# EAGLE design crawler2head (EAGLE 8.5.0)
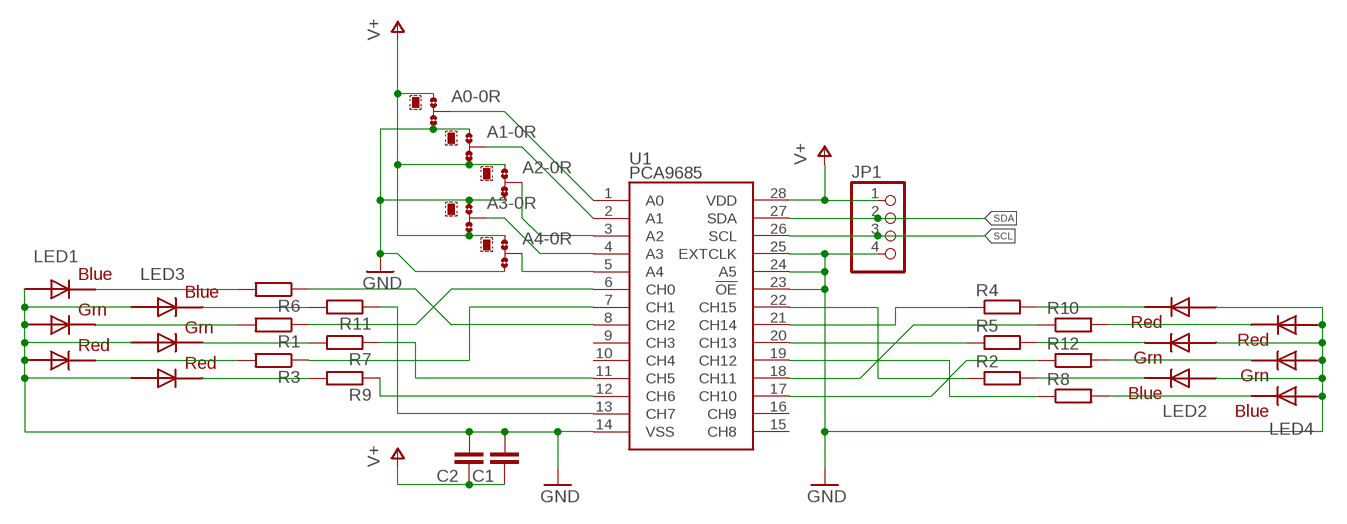
[diagram p0: schematic, sheet 1]

## Parts
A0  A0  0R-JUMPB  [B0R-JMP]
A1  0R-JUMPB  [B0R-JMP]
A2  0R-JUMPB  [B0R-JMP]
A3  0R-JUMPB  [B0R-JMP]
A4  0R-JUMPB  [B0R-JMP]
C1  C-EUC3216  [C3216]
C2  C-EUC0603  [C0603]
JP1  PINHD-1X4/90  [1X04/90]
LED1  RGBLED5050  [RGBLED5050]
LED2  RGBLED5050  [RGBLED5050]
LED3  RGBLED5050  [RGBLED5050]
LED4  RGBLED5050  [RGBLED5050]
R1  R-EU_R0603  [R0603]
R2  R-EU_R0603  [R0603]
R3  R-EU_R0603  [R0603]
R4  R-EU_R0603  [R0603]
R5  R-EU_R0603  [R0603]
R6  R-EU_R0603  [R0603]
R7  R-EU_R0603  [R0603]
R8  R-EU_R0603  [R0603]
R9  R-EU_R0603  [R0603]
R10  R-EU_R0603  [R0603]
R11  R-EU_R0603  [R0603]
R12  R-EU_R0603  [R0603]
U1  PCA9685  [TSSOP-28_4MM]

## Nets
GND: A0.3 A1.1 A2.3 A3.1 A4.3 C1.2 C2.2 JP1.4 LED1.1(GREEN_A) LED1.2(RED_A) LED1.3(BLUE_A) LED2.1(GREEN_A) LED2.2(RED_A) LED2.3(BLUE_A) LED3.1(GREEN_A) LED3.2(RED_A) LED3.3(BLUE_A) LED4.1(GREEN_A) LED4.2(RED_A) LED4.3(BLUE_A) U1.14(VSS) U1.23(!OE) U1.24(A5) U1.25(EXTCLK)
N$1: A4.2 U1.5(A4)
N$2: A3.2 U1.4(A3)
N$3: A2.2 U1.3(A2)
N$4: A1.2 U1.2(A1)
N$5: A0.2 U1.1(A0)
N$17: LED2.5(RED_C) R4.2
N$18: LED2.6(GREEN_C) R5.2
N$19: LED2.4(BLUE_C) R2.2
N$20: LED4.5(RED_C) R10.2
N$21: LED4.6(GREEN_C) R12.2
N$22: LED4.4(BLUE_C) R8.2
N$23: R2.1 U1.22(CH15)
N$24: R4.1 U1.21(CH14)
N$25: R5.1 U1.20(CH13)
N$26: R8.1 U1.19(CH12)
N$27: R10.1 U1.18(CH11)
N$28: R12.1 U1.17(CH10)
N$29: R11.1 U1.13(CH7)
N$30: R9.1 U1.12(CH6)
N$31: R7.1 U1.11(CH5)
N$32: LED3.5(RED_C) R9.2
N$33: LED3.6(GREEN_C) R7.2
N$34: LED3.4(BLUE_C) R11.2
N$35: LED1.5(RED_C) R3.2
N$36: LED1.6(GREEN_C) R1.2
N$37: LED1.4(BLUE_C) R6.2
N$38: R6.1 U1.8(CH2)
N$39: R3.1 U1.7(CH1)
N$40: R1.1 U1.6(CH0)
SCL: JP1.3 U1.26(SCL)
SDA: JP1.2 U1.27(SDA)
V+: A0.1 A1.3 A2.1 A3.3 A4.1 C1.1 C2.1 JP1.1 U1.28(VDD)
Unconnected: U1.9(CH3) U1.10(CH4) U1.15(CH8) U1.16(CH9)

## Library data of the parts
A0 A1-A4 = jump-0r-smd:0R-JUMP: SMD 0R 0805 Jumper
C1 C2 = rcl:C-EU: CAPACITOR, European symbol; SPICEPREFIX: C
JP1 = pinhead:PINHD-1X4: PIN HEADER
LED1-LED4 = adafruit:RGBLED: For 5050 RGB LEDs, the order of the LEDs may vary from one manufacturer to another!
R1-R12 = rcl:R-EU_: RESISTOR, European symbol; SPICEPREFIX: R
U1 = SparkFun-IC-Special-Function:PCA9685: 16-channel 12-bit PWM I2C interface Internal Oscillator 40Hz to 1kHz Can be totem pole or open collector 2.3V to 5.5V SparkFun Products SparkFun Block for Intel® Edison - PWM <https://www.sparkfun.com/products/13042> (DEV-13042) PROTO: IC-12240 PROD_ID: IC-12271; PROD_ID: IC-12271

## Board
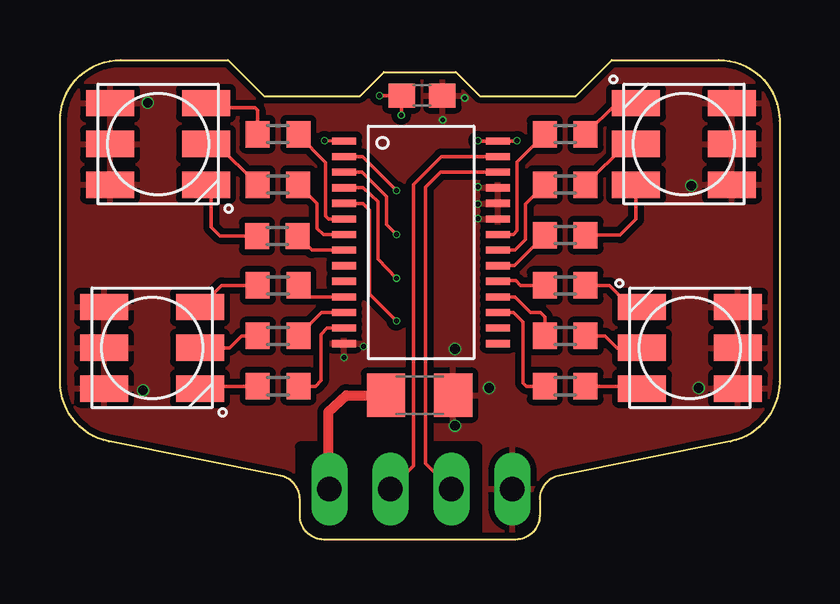
[diagram p1: board, top side]
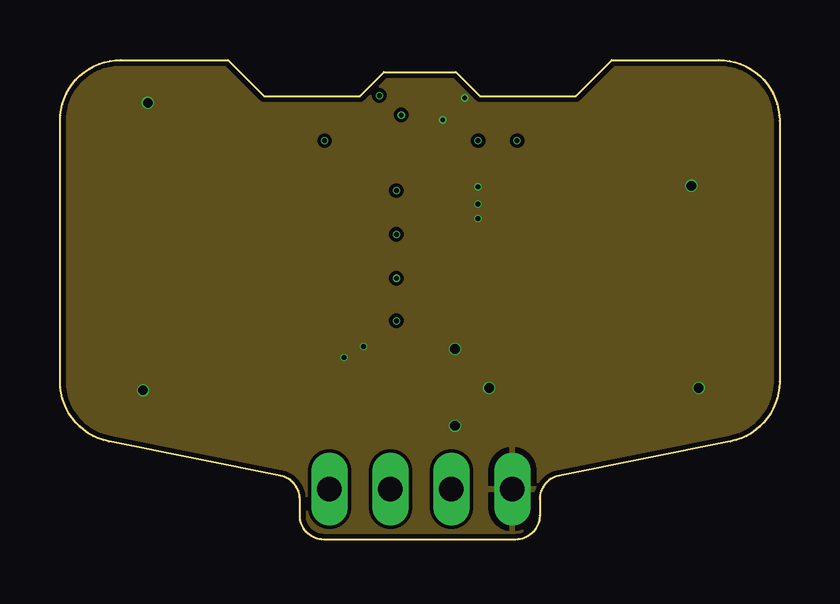
[diagram p2: board, inner layer Route2]
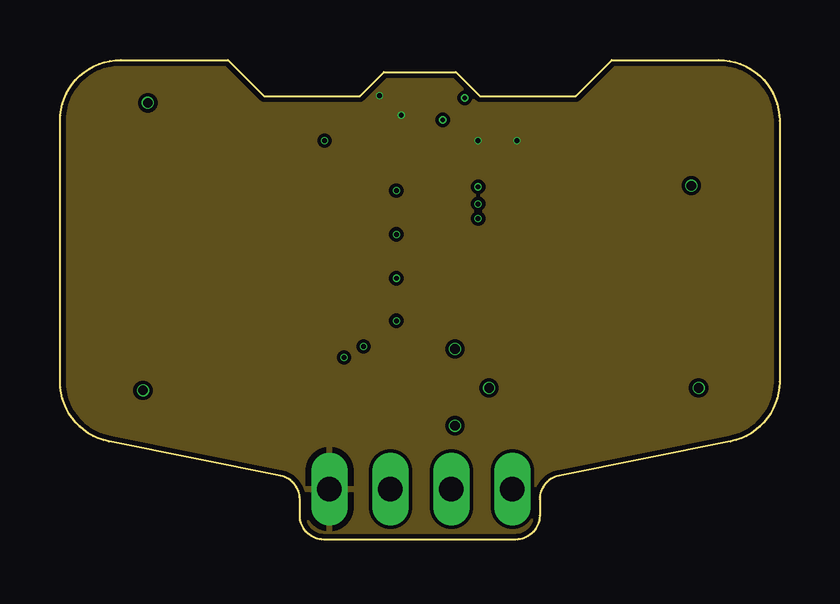
[diagram p3: board, inner layer Route15]
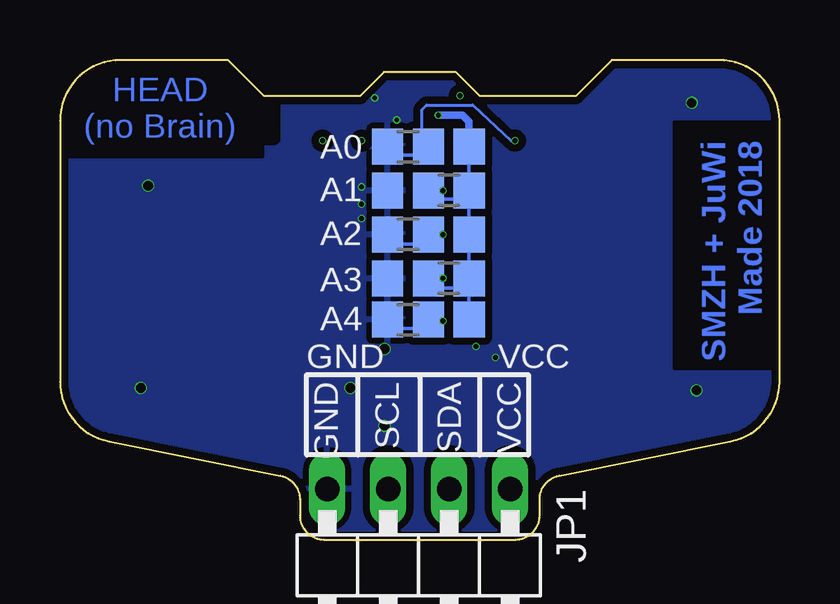
[diagram p4: board, bottom side, seen from below]

Size 30 x 20 mm. Coordinates in mm from the lower left corner, seen from the top.
Outline: 27.96,4.09 20.8,2.66 arc79 20,1.68 20,1 arc-90 19,0 11,0 arc-90 10,1 10,1.68 arc79 9.2,2.66 2.04,4.09 arc-79 0,6.58 0,17.46 arc-90 2.54,20 7,20 8.5,18.5 12.5,18.5 13.5,19.5 16.5,19.5 17.5,18.5 21.5,18.5 23,20 27.46,20 arc-90 30,17.46 30,6.58 arc-79 27.96,4.09
Copper layers (1+2*15+16): Top 0.035mm / dielectric 0.45mm / Route2 0.035mm / dielectric 0.45mm / Route15 0.035mm / dielectric 0.45mm / Bottom 0.035mm
Design rules "aisler_go_2layer *": minimum track width 0.1mm, minimum drill 0.2mm, track to track 0.15mm, track to pad 0.15mm, pad to pad 0.15mm, via to via 0.15mm, smd to smd 0mil, copper to edge 0.2mm, drill to drill 0.21mm, minimum pad ring 0.25mm, minimum via ring 0.05mm, stop-mask expansion 0.01mm, vias tented up to drill 48mil, thermal gap 10mil

### Footprints (pad centres in the part's own frame; a part is rotated, then mirrored left to right if it is on the bottom)
B0R-JMP = smd 1.5 x 1.3: 1 0,1.7; 2 0,0; 3 0,-1.7
C3216 = smd 1.6 x 1.8: 1 -1.4,0; 2 1.4,0
C0603 = smd 1.1 x 1: 1 -0.85,0; 2 0.85,0
1X04/90 = drill 1.016 long: 1 -3.81,-3.81; 2 -1.27,-3.81; 3 1.27,-3.81; 4 3.81,-3.81
RGBLED5050 = smd 2 x 1.1: 1 -2,1.7; 2 -2,0; 3 -2,-1.7; 4 2,-1.7; 5 2,0; 6 2,1.7
R0603 = smd 1 x 1.1: 1 -0.85,0; 2 0.85,0
TSSOP-28_4MM = smd 1 x 0.3: 1 -3.2,4.225; 2 -3.2,3.575; 3 -3.2,2.925; 4 -3.2,2.275; 5 -3.2,1.625; 6 -3.2,0.975; 7 -3.2,0.325; 8 -3.2,-0.325; 9 -3.2,-0.975; 10 -3.2,-1.625; 11 -3.2,-2.275; 12 -3.2,-2.925; 13 -3.2,-3.575; 14 -3.2,-4.225; 15 3.2,-4.225; 16 3.2,-3.575; 17 3.2,-2.925; 18 3.2,-2.275; 19 3.2,-1.625; 20 3.2,-0.975; 21 3.2,-0.325; 22 3.2,0.325; 23 3.2,0.975; 24 3.2,1.625; 25 3.2,2.275; 26 3.2,2.925; 27 3.2,3.575; 28 3.2,4.225

### Placement (x,y rotation side)
A0  14.64,16.38 270 bottom
A1  14.64,14.55 90 bottom
A2  14.64,12.72 270 bottom
A3  14.64,10.9 90 bottom
A4  14.64,9.17 270 bottom
C1  14.99,6.02 0 top
C2  15.1,18.52 0 top
JP1  15.04,-1.7 180 bottom
LED1  4.09,16.5 0 top
LED2  26.01,16.5 180 top
LED3  3.84,8 0 top
LED4  26.26,8 180 top
R1  9.09,16.9 180 top
R2  21.06,16.9 0 top
R3  9.08,14.8 180 top
R4  21.06,14.8 0 top
R5  21.06,12.69 0 top
R6  9.07,12.66 180 top
R7  9.09,10.6 180 top
R8  21.06,10.6 0 top
R9  9.09,8.5 180 top
R10  21.06,8.5 0 top
R11  9.09,6.39 180 top
R12  21.06,6.39 0 top
U1  15.05,12.39 0 top

### Tracks (layer width: path | path; a pad name or v marks a point on that pad's centre or on a via)
GND  (via drill 0.2, 0.4)
  other vias: 17.89,6.32 16.47,7.95 26.63,6.32 26.32,14.76 3.67,18.21 3.46,6.22 15.96,17.5 16.87,18.41 17.43,13.99 17.43,14.71 17.43,13.38 11.84,7.59 12.66,8.05 16.47,4.75
  pour Top (isolate 0.254): -0.5,20.5 30.5,20.5 30.5,0.5 30.5,-0.5 -0.5,-0.5
  pour Bottom (isolate 0.305): -0.5,20.5 30.5,20.5 30.5,0.5 30.5,-0.5 -0.5,-0.5
  pour Route2: -0.5,20.5 30.5,20.5 30.5,0.5 30.5,-0.5 -0.5,-0.5
  cutout Top: 10,3.88 10,0 17.4,0 17.4,3.88
  cutout Bottom: 4.38,17.4 -0.55,17.4 -0.55,7.14 4.38,7.14
  cutout Bottom: 30.23,20.9 30.23,15.98 21.55,15.98 21.55,20.9
N$1  (via drill 0.2)
  Top 0.152: v14.03,9.12 12.91,10.23 12.91,13.74 12.63,14.02 U1.5
  Bottom 0.152: A4.2 14.08,9.17 v14.03,9.12
N$2  (via drill 0.2)
  Top 0.152: v14.03,10.89 13.27,11.71 13.27,14.1 12.64,14.67 U1.4
  Bottom 0.152: A3.2 v14.03,10.89
N$3  (via drill 0.2)
  Top 0.152: v14.03,12.72 13.62,13.13 13.62,14.3 12.6,15.32 U1.3
  Bottom 0.152: A2.2 v14.03,12.72
N$4  (via drill 0.2)
  Top 0.152: v14.03,14.55 12.61,15.97 U1.2
  Bottom 0.152: A1.2 v14.03,14.55
N$5  (via drill 0.2)
  Top 0.127: v11.03,16.64 11.84,16.64 U1.1
  Bottom 0.127: v11.03,16.64 11.21,16.64 12.79,18.12 14.72,18.12 14.9,17.93 14.9,16.9 14.69,16.69 14.55,16.47 A0.2
N$6
  Bottom 0.152: 14.33,14.2 13.32,14.2
N$7
  Bottom 0.152: 16.06,16.03 14.94,16.03
N$8
  Bottom 0.152: 15.96,12.32 14.99,12.32
N$9
  Bottom 0.152: 16.01,8.81 15.04,8.81
N$10
  Bottom 0.152: 14.23,10.49 13.37,10.49
N$17
  Top 0.152: LED2.5 23.61,16.5 R4.2
N$18
  Top 0.152: LED2.6 24.01,13.36 23.35,12.7 R5.2
N$19
  Top 0.152: LED2.4 23.21,18.2 R2.2
N$20
  Top 0.152: LED4.5 23.23,8 22.73,8.5 R10.2
N$21
  Top 0.152: LED4.6 24.16,6.39 R12.2
N$22
  Top 0.152: LED4.4 23.83,9.68 22.91,10.6 R8.2
N$23
  Top 0.152: R2.1 19.06,15.74 19.06,12.88 18.9,12.72 U1.22
N$24
  Top 0.152: R4.1 19.41,14 19.41,12.52 18.96,12.07 U1.21
N$25
  Top 0.152: R5.1 18.94,11.42 U1.20
N$26
  Top 0.152: R8.1 19.2,10.6 19.01,10.79 18.28,10.79 U1.19
N$27
  Top 0.152: U1.18 18.97,10.12 19.62,9.47 20.02,9.47 20.21,9.28 R10.1
N$28
  Top 0.152: U1.17 18.91,9.47 19.31,9.07 19.31,6.53 19.44,6.39 R12.1
N$29
  Top 0.152: U1.13 11.14,8.82 10.88,8.56 10.88,6.63 10.65,6.39 R11.1
N$30
  Top 0.152: U1.12 10.91,9.47 R9.1
N$31
  Top 0.152: U1.11 10.42,10.12 R7.1
N$32
  Top 0.152: LED3.5 7.07,8 7.57,8.5 R9.2
N$33
  Top 0.152: LED3.6 6.74,10.6 R7.2
N$34
  Top 0.152: LED3.4 5.94,6.39 R11.2
N$35
  Top 0.152: LED1.5 6.54,16.5 R3.2
N$36
  Top 0.152: LED1.6 6.28,18.01 8.14,18.01 8.24,17.91 R1.2
N$37
  Top 0.152: LED1.4 6.31,14.58 6.31,13.03 6.68,12.66 R6.2
N$38
  Top 0.152: U1.8 10.5,12.07 R6.1
N$39
  Top 0.152: U1.7 10.98,12.72 10.73,12.98 10.73,14.01 R3.1
N$40
  Top 0.152: U1.6 11.2,13.37 11.08,13.49 11.08,15.72 9.94,16.87 R1.1
SCL
  Top 0.15: 15.25,4.94 15.25,14.7 15.86,15.32 U1.26
  Top 0.152: 15.25,4.94 15.25,3.17 JP1.3
SDA
  Top 0.15: U1.27 15.9,15.97 14.74,14.81 14.74,13.03 14.74,11.25 14.74,4.85
  Top 0.152: 14.74,4.85 14.74,3.07 JP1.2
V+  (via drill 0.2)
  Top 0.15: v14.23,17.7 14.25,17.72 C2.1 v13.32,18.52 | v17.43,16.64 17.45,16.62 U1.28 19.04,16.62 v19.06,16.64
  Top 0.406: C1.1 11.95,6.02 11.18,5.31 11.18,2.16 JP1.1
  Bottom 0.152: A0.1 A1.3 A2.1 A3.3 A4.1
  Bottom 0.305: v14.23,17.7 13.22,17.7 12.94,17.43 A0.1
  pour Route15: -0.5,20.5 30.5,20.5 30.5,0.5 30.5,-0.5 -0.5,-0.5

### Text on the board
Bottom: SMZH + JuWi / Made 2018 | HEAD / (no Brain)
bPlace: A0 | A1 | A2 | A3 | A4 | VCC | GND | VCC | SDA | SCL | GND